# EAGLE design zero_board (EAGLE 6.6.0)
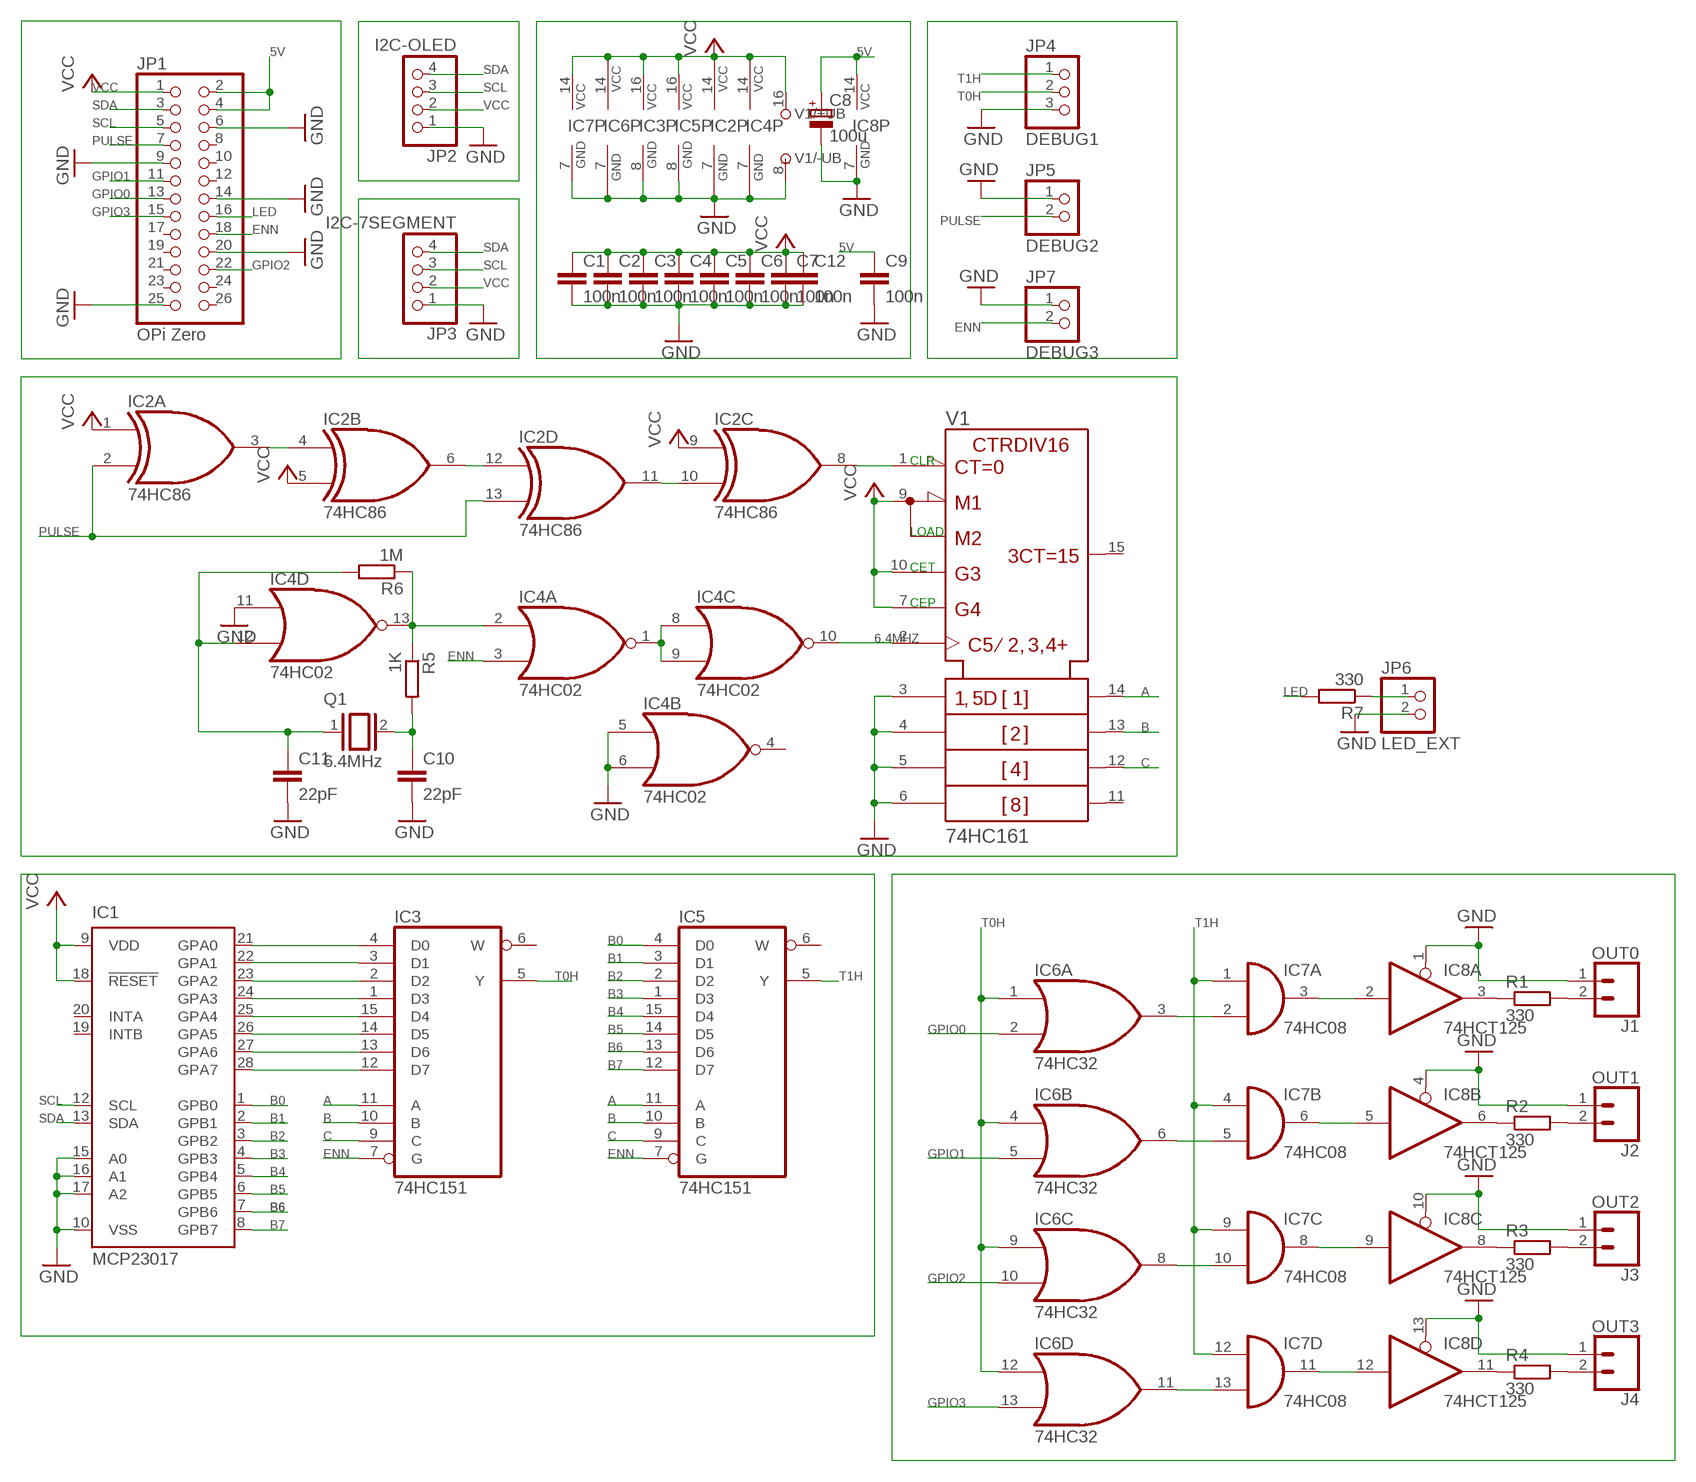
[diagram p0: schematic, sheet 1]

## Parts
C1  100n  C-EU050-024X044  [C050-024X044]
C2  100n  C-EU050-024X044  [C050-024X044]
C3  100n  C-EU050-024X044  [C050-024X044]
C4  100n  C-EU050-024X044  [C050-024X044]
C5  100n  C-EU050-024X044  [C050-024X044]
C6  100n  C-EU050-024X044  [C050-024X044]
C7  100n  C-EU050-024X044  [C050-024X044]
C8  100u  CPOL-EUE2.5-6  [E2,5-6]
C9  100n  C-EU050-024X044  [C050-024X044]
C10  22pF  C-EU050-024X044  [C050-024X044]
C11  22pF  C-EU050-024X044  [C050-024X044]
C12  100n  C-EU050-024X044  [C050-024X044]
IC1  MCP23017  MCP23017SP  [DIL28-3]
IC2  74HC86  74LS86N  [DIL14]
IC3  74HC151  74HC151N  [DIL16]
IC4  74HC02  7402N  [DIL14]
IC5  74HC151  74HC151N  [DIL16]
IC6  74HC32  74LS32N  [DIL14]
IC7  74HC08  74AS08N  [DIL14]
IC8  74HCT125  74HC125N  [DIL14]
J1  OUT0  CONN_023.5MM  [SCREWTERMINAL-3.5MM-2]
J2  OUT1  CONN_023.5MM  [SCREWTERMINAL-3.5MM-2]
J3  OUT2  CONN_023.5MM  [SCREWTERMINAL-3.5MM-2]
J4  OUT3  CONN_023.5MM  [SCREWTERMINAL-3.5MM-2]
JP1  OPi Zero  PINHD-2X13  [2X13]
JP2  I2C-OLED  PINHD-1X4  [1X04]
JP3  I2C-7SEGMENT  PINHD-1X4  [1X04]
JP4  DEBUG1  PINHD-1X3/90  [1X03/90]
JP5  DEBUG2  PINHD-1X2/90  [1X02/90]
JP6  LED_EXT  PINHD-1X2/90  [1X02/90]
JP7  DEBUG3  PINHD-1X2/90  [1X02/90]
Q1  6.4MHz  XTAL/S  [QS]
R1  330  R-EU_0204/5  [0204/5]
R2  330  R-EU_0204/5  [0204/5]
R3  330  R-EU_0204/5  [0204/5]
R4  330  R-EU_0204/5  [0204/5]
R5  1K  R-EU_0204/2V  [0204V]
R6  1M  R-EU_0204/2V  [0204V]
R7  330  R-EU_0204/2V  [0204V]
V1  74HC161  74161N  [DIL16]

## Nets
5V: C8.+ C9.1 IC8.14(P:VCC) JP1.2 JP1.4
6.4MHZ: IC4.10(C:O) V1.2(CLK)
A: IC3.11(A) IC5.11(A) V1.14(QA)
B: IC3.10(B) IC5.10(B) V1.13(QB)
B0: IC1.1(GPB0) IC5.4(D0)
B1: IC1.2(GPB1) IC5.3(D1)
B2: IC1.3(GPB2) IC5.2(D2)
B3: IC1.4(GPB3) IC5.1(D3)
B4: IC1.5(GPB4) IC5.15(D4)
B5: IC1.6(GPB5) IC5.14(D5)
B6: IC1.7(GPB6) IC5.13(D6)
B7: IC1.8(GPB7) IC5.12(D7)
C: IC3.9(C) IC5.9(C) V1.12(QC)
ENN: IC3.7(G) IC4.3(A:I1) IC5.7(G) JP1.18 JP7.2
GND: C1.2 C2.2 C3.2 C4.2 C5.2 C6.2 C7.2 C8.- C9.2 C10.2 C11.2 C12.2 IC1.10(VSS) IC1.15(A0) IC1.16(A1) IC1.17(A2) IC2.7(P:GND) IC3.8(GND) IC4.5(B:I0) IC4.6(B:I1) IC4.7(P:GND) IC4.11(D:I0) IC5.8(GND) IC6.7(P:GND) IC7.7(P:GND) IC8.1(A:OE) IC8.4(B:OE) IC8.7(P:GND) IC8.10(C:OE) IC8.13(D:OE) J1.1 J2.1 J3.1 J4.1 JP1.6 JP1.9 JP1.14 JP1.20 JP1.25 JP2.1 JP3.1 JP4.3 JP5.1 JP6.2 JP7.1 V1.3(A) V1.4(B) V1.5(C) V1.6(D) V1.8(-UB)
GPIO0: IC6.2(A:I1) JP1.13
GPIO1: IC6.5(B:I1) JP1.11
GPIO2: IC6.10(C:I1) JP1.22
GPIO3: IC6.13(D:I1) JP1.15
LED: JP1.16 R7.2
N$1: IC2.3(A:O) IC2.4(B:I0)
N$2: IC2.6(B:O) IC2.12(D:I0)
N$3: IC2.10(C:I1) IC2.11(D:O)
N$4: IC2.8(C:O) V1.1(!CLR)
N$5: IC6.3(A:O) IC7.2(A:I1)
N$6: IC6.6(B:O) IC7.5(B:I1)
N$7: IC1.21(GPA0) IC3.4(D0)
N$8: IC1.22(GPA1) IC3.3(D1)
N$9: IC1.23(GPA2) IC3.2(D2)
N$10: IC1.24(GPA3) IC3.1(D3)
N$11: IC1.25(GPA4) IC3.15(D4)
N$12: IC1.26(GPA5) IC3.14(D5)
N$13: IC1.27(GPA6) IC3.13(D6)
N$14: IC1.28(GPA7) IC3.12(D7)
N$15: IC6.8(C:O) IC7.10(C:I1)
N$16: IC6.11(D:O) IC7.13(D:I1)
N$17: IC7.11(D:O) IC8.12(D:I)
N$18: IC7.8(C:O) IC8.9(C:I)
N$19: IC7.6(B:O) IC8.5(B:I)
N$20: IC7.3(A:O) IC8.2(A:I)
N$21: IC8.3(A:O) R1.1
N$22: J1.2 R1.2
N$23: IC8.6(B:O) R2.1
N$24: J2.2 R2.2
N$25: IC8.8(C:O) R3.1
N$26: J3.2 R3.2
N$27: IC8.11(D:O) R4.1
N$28: J4.2 R4.2
N$35: IC4.1(A:O) IC4.8(C:I0) IC4.9(C:I1)
N$37: IC4.2(A:I0) IC4.13(D:O) R5.1 R6.1
N$38: C10.1 Q1.2 R5.2
N$39: JP6.1 R7.1
N$41: C11.1 IC4.12(D:I1) Q1.1 R6.2
PULSE: IC2.2(A:I1) IC2.13(D:I1) JP1.7 JP5.2
SCL: IC1.12(SCL) JP1.5 JP2.3 JP3.3
SDA: IC1.13(SDA) JP1.3 JP2.4 JP3.4
T0H: IC3.5(Y) IC6.1(A:I0) IC6.4(B:I0) IC6.9(C:I0) IC6.12(D:I0) JP4.2
T1H: IC5.5(Y) IC7.1(A:I0) IC7.4(B:I0) IC7.9(C:I0) IC7.12(D:I0) JP4.1
VCC: C1.1 C2.1 C3.1 C4.1 C5.1 C6.1 C7.1 C12.1 IC1.9(VDD) IC1.18(!RESET) IC2.1(A:I0) IC2.5(B:I1) IC2.9(C:I0) IC2.14(P:VCC) IC3.16(VCC) IC4.14(P:VCC) IC5.16(VCC) IC6.14(P:VCC) IC7.14(P:VCC) JP1.1 JP2.2 JP3.2 V1.7(ENP) V1.9(!LOAD) V1.10(ENT) V1.16(+UB)
Unconnected: IC1.19(INTB) IC1.20(INTA) IC3.6(W) IC4.4(B:O) IC5.6(W) JP1.8 JP1.10 JP1.12 JP1.17 JP1.19 JP1.21 JP1.23 JP1.24 JP1.26 V1.11(QD) V1.15(RCO)

## Notes on the sheet
- CLR
- LOAD
- CET
- CEP

## Library data of the parts
C1-C7 C9-C12 = rcl:C-EU: CAPACITOR, European symbol
C8 = rcl:CPOL-EU: POLARIZED CAPACITOR, European symbol
IC1 = microchip:MCP23017: http://ww1.microchip.com/downloads/en/DeviceDoc/21952a.pdf Source: http://ww1.microchip.com/downloads/en/DeviceDoc/21952a.pdf; MF: MICROCHIP; MPN: MCP23017-E/SP; OC_FARNELL: 1332088; OC_NEWARK: 31K2959
IC2 = 74xx-us:74*86: Quad 2-input EXCLUSIV-OR (XOR) gate
IC3 IC5 = 74xx-eu:74*151: Data SELECTOR/MULTIPLEXER
IC4 = 74xx-us:74*02: Quad 2-input NOR gate
IC6 = 74xx-us:74*32: Quad 2-input OR gate
IC7 = 74xx-eu:74*08: Quad 2-input AND gate
IC8 = 74xx-eu:74*125: Quad bus BUFFER, 3-state
J1-J4 = SparkFun-Connectors:CONN_02: Multi connection point. Often used as Generic Header-pin footprint for 0.1 inch spaced/style header connections On any of the 0.1 inch spaced packages, you can populate with these: Break Away Headers - Straight <https://www.sparkfun.com/products/116> (PRT-00116) Break Away Male Headers - Right Angle <https://www.sparkfun.com/products/553> (PRT-00553) Female Headers <https://www.sparkfun.com/products/115> (PRT-00115) Break Away Headers - Machine Pin <https://www.sparkfun.com/products/117> (PRT-00117) Break Away Female Headers - Swiss Machine Pin <https://www.sparkfun.com/products/743> (PRT-00743) For SCREWTERMINALS and SPRING TERMINALS visit here: Screw Terimnals on SparkFun.com <https://www.sparkfun.com/search/results?term=Screw+Terminals> (5mm/3.5mm/2.54mm spacing) This device is also useful as a general connection point to wire up your design to another part of your project. Our various solder wires solder well into these plated through hole pads. Hook-Up Wire - Assortment (Stranded, 22 AWG) <https://www.sparkfun.com/products/11375> (PRT-11375) Hook-Up Wire - Assortment (Solid Core, 22 AWG) <https://www.sparkfun.com/products/11367> (PRT-11367) View the entire wire category on our website here <https://www.sparkfun.com/categories/141> Special notes: Molex polarized connector foot print use with: PRT-08233 with associated crimp pins and housings. 2.54_SCREWTERM for use with PRT-10571. 3.5mm Screw Terminal footprints for PRT-08084 5mm Screw Terminal footprints for use with PRT-08432; PROD_ID: CONN-08399
JP1 = pinhead:PINHD-2X13: PIN HEADER
JP2 JP3 = pinhead:PINHD-1X4: PIN HEADER
JP4 = pinhead:PINHD-1X3: PIN HEADER
JP5-JP7 = pinhead:PINHD-1X2: PIN HEADER
Q1 = special:XTAL/S: CRYSTAL
R1-R7 = resistor:R-EU_: RESISTOR, European symbol
V1 = 74ttl-din:74*161: Synchrounus 4-bit COUNTER

## Board
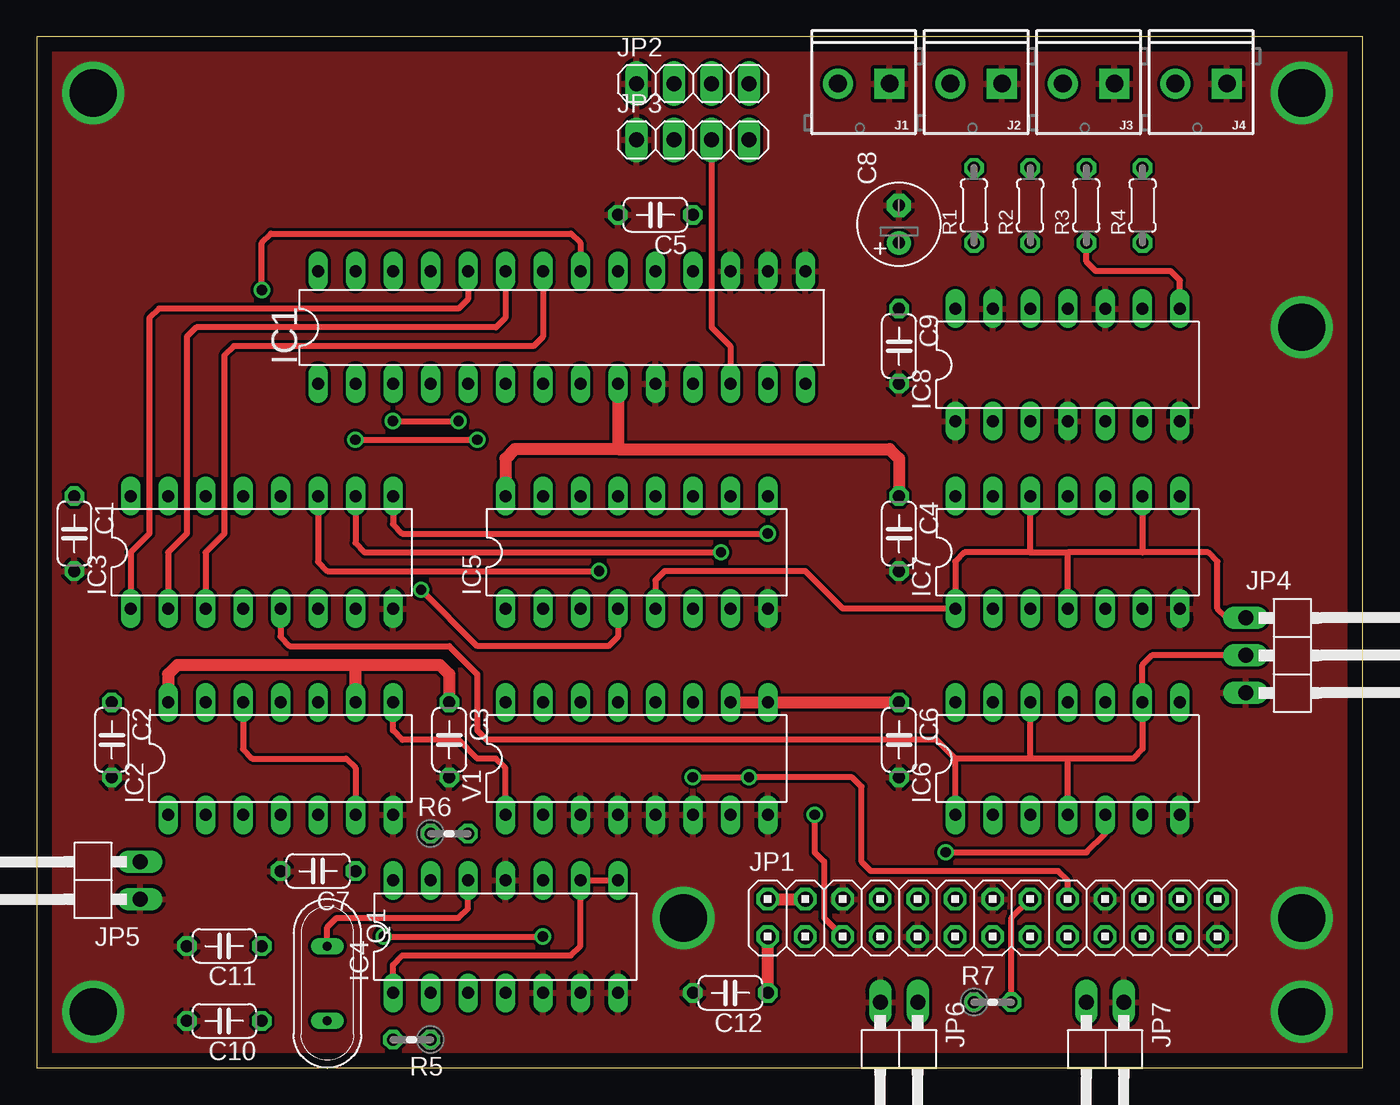
[diagram p1: board, top side]
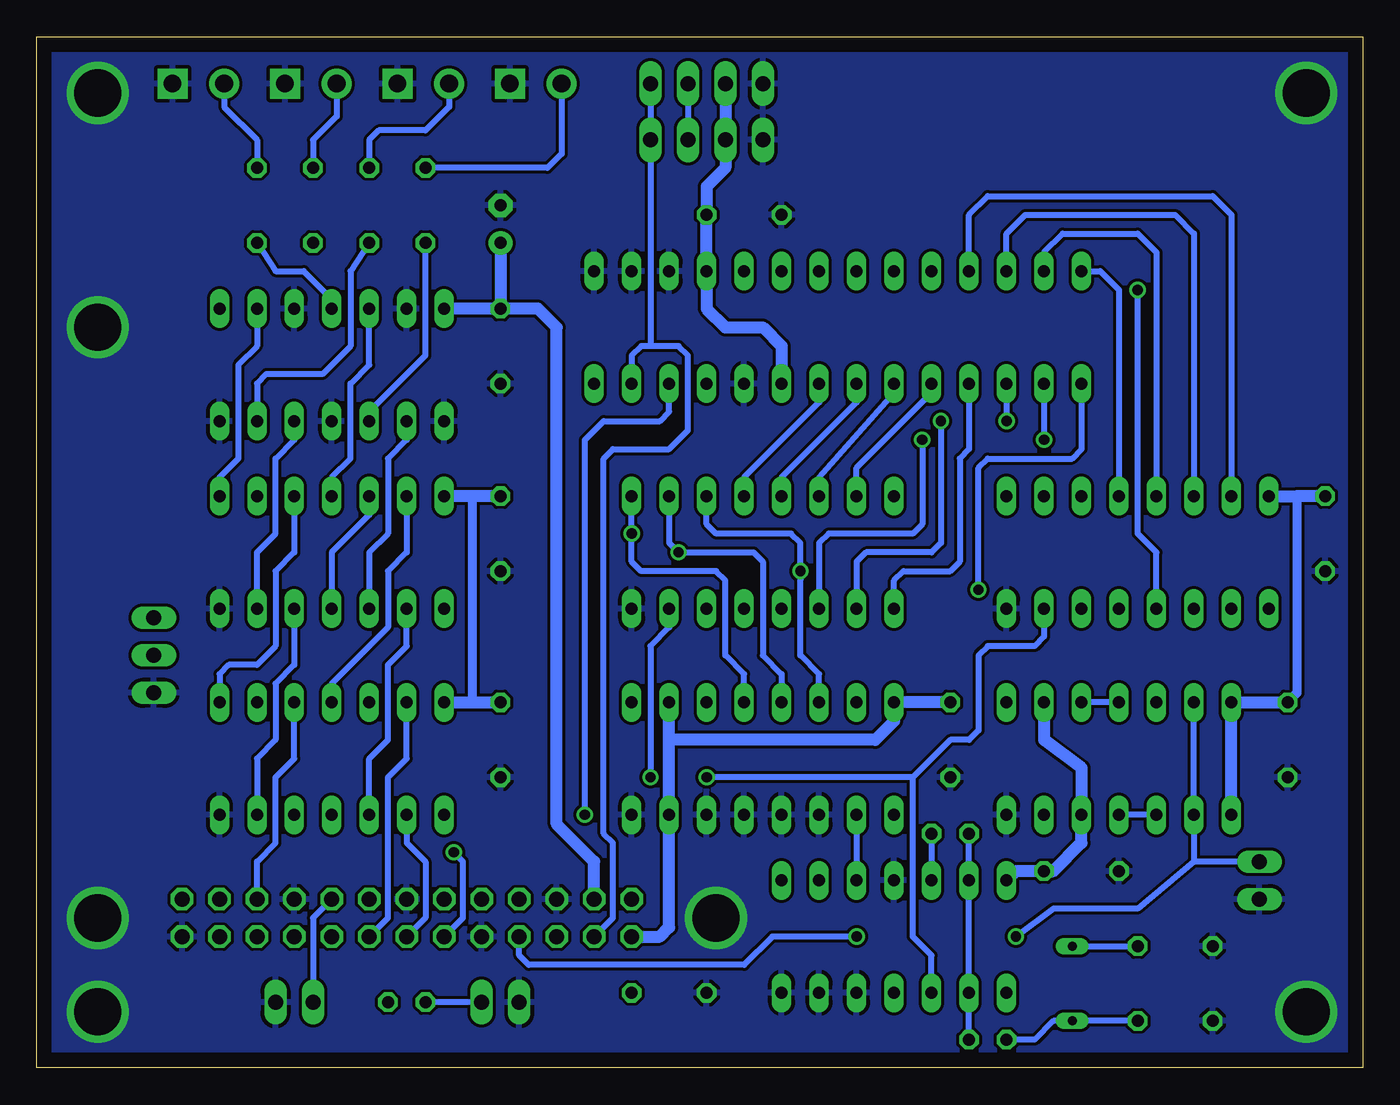
[diagram p2: board, bottom side, seen from below]

Size 89.84 x 69.84 mm. Coordinates in mm from the lower left corner, seen from the top.
Outline: 0,0 89.84,0 89.84,69.84 0,69.84 0,0
Copper layers (1*16): Top 0.035mm / dielectric 1.5mm / Bottom 0.035mm
Design rules "default": minimum track width 10mil, minimum drill 24mil, track to track 8mil, track to pad 8mil, pad to pad 8mil, via to via 8mil, smd to smd 8mil, copper to edge 40mil, drill to drill 8mil, minimum pad ring 10mil, minimum via ring 8mil, stop-mask expansion 4mil, vias tented up to drill 0mil, thermal gap 10mil

### Footprints (pad centres in the part's own frame; a part is rotated, then mirrored left to right if it is on the bottom)
C050-024X044 = drill 0.813 octagon: 1 -2.54,0; 2 2.54,0
E2,5-6 = drill 0.813 pad 1.6: + -1.27,0 | drill 0.813 pad 1.6 octagon: - 1.27,0
DIL28-3 = drill 0.813 long: 1 -16.51,-3.81; 2 -13.97,-3.81; 3 -11.43,-3.81; 4 -8.89,-3.81; 5 -6.35,-3.81; 6 -3.81,-3.81; 7 -1.27,-3.81; 8 1.27,-3.81; 9 3.81,-3.81; 10 6.35,-3.81; 11 8.89,-3.81; 12 11.43,-3.81; 13 13.97,-3.81; 14 16.51,-3.81; 15 16.51,3.81; 16 13.97,3.81; 17 11.43,3.81; 18 8.89,3.81; 19 6.35,3.81; 20 3.81,3.81; 21 1.27,3.81; 22 -1.27,3.81; 23 -3.81,3.81; 24 -6.35,3.81; 25 -8.89,3.81; 26 -11.43,3.81; 27 -13.97,3.81; 28 -16.51,3.81
DIL14 = drill 0.813 long: 1 -7.62,-3.81; 2 -5.08,-3.81; 3 -2.54,-3.81; 4 0,-3.81; 5 2.54,-3.81; 6 5.08,-3.81; 7 7.62,-3.81; 8 7.62,3.81; 9 5.08,3.81; 10 2.54,3.81; 11 0,3.81; 12 -2.54,3.81; 13 -5.08,3.81; 14 -7.62,3.81
DIL16 = drill 0.813 long: 1 -8.89,-3.81; 2 -6.35,-3.81; 3 -3.81,-3.81; 4 -1.27,-3.81; 5 1.27,-3.81; 6 3.81,-3.81; 7 6.35,-3.81; 8 8.89,-3.81; 9 8.89,3.81; 10 6.35,3.81; 11 3.81,3.81; 12 1.27,3.81; 13 -1.27,3.81; 14 -3.81,3.81; 15 -6.35,3.81; 16 -8.89,3.81
SCREWTERMINAL-3.5MM-2 = drill 1.2 pad 2.032 square: 1 0,0 | drill 1.2 pad 2.032: 2 3.5,0
2X13 = drill 1.016 octagon: 1 -15.24,-1.27; 2 -15.24,1.27; 3 -12.7,-1.27; 4 -12.7,1.27; 5 -10.16,-1.27; 6 -10.16,1.27; 7 -7.62,-1.27; 8 -7.62,1.27; 9 -5.08,-1.27; 10 -5.08,1.27; 11 -2.54,-1.27; 12 -2.54,1.27; 13 0,-1.27; 14 0,1.27; 15 2.54,-1.27; 16 2.54,1.27; 17 5.08,-1.27; 18 5.08,1.27; 19 7.62,-1.27; 20 7.62,1.27; 21 10.16,-1.27; 22 10.16,1.27; 23 12.7,-1.27; 24 12.7,1.27; 25 15.24,-1.27; 26 15.24,1.27
1X04 = drill 1.016 long: 1 -3.81,0; 2 -1.27,0; 3 1.27,0; 4 3.81,0
1X03/90 = drill 1.016 long: 1 -2.54,-3.81; 2 0,-3.81; 3 2.54,-3.81
1X02/90 = drill 1.016 long: 1 -1.27,-3.81; 2 1.27,-3.81
QS = drill 0.61 long: 1 -2.54,0; 2 2.54,0
0204/5 = drill 0.813 octagon: 1 -2.54,0; 2 2.54,0
0204V = drill 0.813 octagon: 1 -1.27,0; 2 1.27,0

### Placement (x,y rotation side)
C1  2.54,36.2 270 top
C2  5.08,22.23 270 top
C3  27.94,22.23 270 top
C4  58.42,36.2 270 top
C5  41.91,57.78 180 top
C6  58.42,22.23 270 top
C7  19.05,13.34 180 top
C8  58.42,57.15 90 top
C9  58.42,48.89 270 top
C10  12.7,3.18 180 top
C11  12.7,8.26 180 top
C12  46.99,5.08 180 top
IC1  35.56,50.16 0 top
IC2  16.51,20.96 0 top
IC3  15.24,34.92 0 top
IC4  31.75,8.89 0 top
IC5  40.64,34.92 0 top
IC6  69.85,20.96 0 top
IC7  69.85,34.92 0 top
IC8  69.85,47.62 0 top
J1  57.78,66.67 180 top
J2  65.41,66.67 180 top
J3  73.03,66.67 180 top
J4  80.65,66.67 180 top
JP1  64.77,10.16 0 top
JP2  44.45,66.67 0 top
JP3  44.45,62.87 0 top
JP4  85.73,27.94 270 top
JP5  3.17,12.7 90 top
JP6  58.42,0.64 180 top
JP7  72.39,0.64 180 top
Q1  19.69,5.71 270 top
R1  63.5,58.42 90 top
R2  67.31,58.42 90 top
R3  71.12,58.42 90 top
R4  74.93,58.42 90 top
R5  25.4,1.9 180 top
R6  27.94,15.88 0 top
R7  64.77,4.45 0 top
V1  40.64,20.96 0 top

### Tracks (layer width: path | path; a pad name or v marks a point on that pad's centre or on a via)
5V
  Top 0.813: JP1.2 JP1.4
  Bottom 0.813: C9.1 IC8.14 | JP1.4 52.07,13.97 54.61,16.51 54.61,50.16 55.88,51.43 C9.1 | C8.+ C9.1
6.4MHZ
  Bottom 0.406: V1.2 IC4.10
A  (via drill 0.7)
  Top 0.406: IC3.11 19.05,34.29 19.69,33.65 v38.1,33.65
  Bottom 0.406: V1.14 36.83,26.67 38.1,27.94 38.1,33.02 v38.1,33.65 38.1,35.56 38.73,36.2 43.81,36.2 44.45,36.83 IC5.11
B  (via drill 0.7)
  Top 0.406: IC3.10 21.59,35.56 22.23,34.92 v46.35,34.92
  Bottom 0.406: IC5.10 46.99,35.56 v46.35,34.92 41.27,34.92 40.64,34.29 40.64,27.94 39.37,26.67 V1.13
B0  (via drill 0.7)
  Top 0.406: IC5.4 39.37,29.21 38.73,28.57 29.85,28.57 v26.04,32.38
  Bottom 0.406: IC1.1 19.05,41.91 19.69,41.27 25.4,41.27 26.04,40.64 v26.04,32.38
B1  (via drill 0.7)
  Top 0.406: v21.59,42.54 v29.85,42.54
  Bottom 0.406: IC1.2 v21.59,42.54 | v29.85,42.54 29.85,36.83 30.48,36.2 36.2,36.2 36.83,35.56 IC5.3
B2  (via drill 0.7)
  Top 0.406: v24.13,43.81 v28.58,43.81
  Bottom 0.406: IC1.3 v24.13,43.81 | v28.58,43.81 28.58,35.56 29.21,34.92 33.66,34.92 34.29,34.29 IC5.2
B3
  Bottom 0.406: IC1.4 26.67,41.91 27.31,41.27 27.31,34.29 27.94,33.65 31.12,33.65 31.75,33.02 IC5.1
B4
  Bottom 0.406: IC5.15 34.29,40.64 29.21,45.72 IC1.5
B5
  Bottom 0.406: IC5.14 36.83,40 31.75,45.72 IC1.6
B6
  Bottom 0.406: IC5.13 39.37,40 34.29,45.08 IC1.7
B7
  Bottom 0.406: IC5.12 41.91,40 36.83,45.08 IC1.8
C  (via drill 0.7)
  Top 0.406: IC3.9 24.13,36.83 24.77,36.2 v49.53,36.2
  Bottom 0.406: V1.12 41.91,26.67 43.18,27.94 43.18,33.02 43.81,33.65 48.89,33.65 49.53,34.29 v49.53,36.2 49.53,38.1 IC5.9
ENN  (via drill 0.7)
  Top 0.406: v44.45,19.68 v48.26,19.68 55.24,19.68 55.88,19.05 55.88,13.97 56.52,13.34 69.22,13.34 69.85,12.7 JP1.18
  Bottom 0.406: IC5.7 46.99,29.84 48.26,28.57 v48.26,19.68 | IC3.7 21.59,29.21 22.23,28.57 25.4,28.57 26.04,27.94 26.04,22.86 26.67,22.23 27.94,22.23 30.48,19.68 | 30.48,19.68 v44.45,19.68 | IC4.3 29.21,7.62 30.48,8.89 30.48,19.68 | JP1.18 71.12,10.16 JP7.2
GND  (via drill 3.2)
  other vias: 85.73,3.81 3.81,3.81 3.81,66.04 85.73,66.04 85.73,10.16 43.81,10.16 85.73,50.16
  pour Bottom: -1.27,0 90.81,0 90.81,70.48 -0.64,70.48
  pour Top: -0.64,0 90.17,0 90.17,69.85 -0.64,69.85
GPIO0
  Bottom 0.406: IC6.2 64.77,15.24 63.5,13.97 63.5,10.16 JP1.13
GPIO1  (via drill 0.7)
  Top 0.406: v61.59,14.61 71.12,14.61 72.39,15.88 IC6.5
  Bottom 0.406: JP1.11 60.96,10.16 60.96,13.97 v61.59,14.61
GPIO2
  Bottom 0.406: JP1.22 74.93,13.97 73.66,15.24 73.66,19.68 72.39,20.96 IC6.10
GPIO3
  Bottom 0.406: JP1.15 66.04,10.16 66.04,19.68 64.77,20.96 IC6.13
LED
  Top 0.406: R7.2 66.04,10.16 JP1.16
N$1
  Bottom 0.406: IC2.3 IC2.4
N$2
  Top 0.406: IC2.12 13.97,21.59 14.61,20.96 20.96,20.96 21.59,20.32 IC2.6
N$3
  Bottom 0.406: IC2.11 IC2.10
N$4
  Top 0.406: V1.1 31.75,20.32 31.12,20.96 29.85,20.96 28.58,22.23 24.77,22.23 24.13,22.86 IC2.8
N$5
  Bottom 0.406: IC6.3 67.31,20.96 66.04,22.23 66.04,27.3 64.77,28.57 IC7.2
N$6
  Bottom 0.406: IC7.5 72.39,27.3 73.66,26.04 73.66,22.23 74.93,20.96 IC6.6
N$7  (via drill 0.7)
  Top 0.406: v15.24,52.7 15.24,55.88 15.88,56.51 36.2,56.51 36.83,55.88 IC1.21
  Bottom 0.406: IC3.4 13.97,34.92 15.24,36.2 v15.24,52.7
N$8
  Top 0.406: IC1.22 34.29,49.53 33.66,48.89 13.33,48.89 12.7,48.26 12.7,36.2 11.43,34.92 IC3.3
N$9
  Top 0.406: IC1.23 31.75,50.8 31.12,50.16 10.79,50.16 10.16,49.53 10.16,36.2 8.89,34.92 IC3.2
N$10
  Top 0.406: IC1.24 29.21,52.07 28.58,51.43 8.26,51.43 7.62,50.8 7.62,36.2 6.35,34.92 IC3.1
N$11
  Bottom 0.406: IC1.25 26.67,57.78 25.4,59.05 10.16,59.05 8.89,57.78 IC3.15
N$12
  Bottom 0.406: IC1.26 24.13,56.51 22.86,57.78 12.7,57.78 11.43,56.51 IC3.14
N$13
  Bottom 0.406: IC1.27 21.59,55.24 20.32,56.51 15.24,56.51 13.97,55.24 IC3.13
N$14
  Bottom 0.406: IC1.28 17.78,53.97 16.51,52.7 IC3.12
N$15
  Bottom 0.406: IC7.10 72.39,34.92 73.66,33.65 73.66,28.57 74.93,27.3 76.84,27.3 77.47,26.67 IC6.8
N$16
  Bottom 0.406: IC7.13 64.77,34.92 66.04,33.65 66.04,29.84 69.85,26.04 IC6.11
N$17
  Bottom 0.406: IC7.11 69.85,40 68.58,41.27 68.58,46.35 67.31,47.62 IC8.12
N$18
  Bottom 0.406: IC7.8 77.47,40 76.2,41.27 76.2,47.62 74.93,48.89 IC8.9
N$19
  Bottom 0.406: IC7.6 74.93,34.92 73.66,36.2 73.66,41.27 72.39,42.54 IC8.5
N$20
  Bottom 0.406: IC8.2 64.77,42.54 66.04,41.27 66.04,36.2 67.31,34.92 IC7.3
N$21
  Bottom 0.406: IC8.3 67.31,44.45 63.5,48.26 R1.1
N$22
  Bottom 0.406: J1.2 54.28,61.92 55.24,60.96 R1.2
N$23
  Bottom 0.406: R2.1 68.58,53.97 68.58,48.89 70.48,46.99 74.3,46.99 74.93,46.35 IC8.6
N$24
  Bottom 0.406: J2.2 61.91,65.09 63.5,63.5 66.68,63.5 67.31,62.87 R2.2
N$25
  Top 0.406: IC8.8 77.47,53.34 76.84,53.97 71.76,53.97 71.12,54.61 R3.1
N$26
  Bottom 0.406: J3.2 69.53,64.46 71.12,62.87 R3.2
N$27
  Bottom 0.406: IC8.11 69.85,52.07 71.76,53.97 73.66,53.97 R4.1
N$28
  Bottom 0.406: J4.2 77.15,65.08 74.93,62.87 R4.2
N$35
  Top 0.406: IC4.8 IC4.9 36.83,8.26 36.2,7.62 24.77,7.62 24.13,6.99 IC4.1
N$37
  Bottom 0.406: R5.1 IC4.2 IC4.13 R6.1
N$38
  Bottom 0.406: R5.2 22.23,1.9 20.96,3.18 Q1.2 C10.1
N$39
  Bottom 0.406: JP6.1 R7.1
N$41
  Top 0.406: Q1.1 19.69,9.53 20.32,10.16 28.58,10.16 29.21,10.79 IC4.12
  Bottom 0.406: Q1.1 C11.1 | R6.2 IC4.12
PULSE  (via drill 0.7)
  Top 0.406: v23.5,8.89 v34.29,8.89
  Bottom 0.406: IC2.13 IC2.2 11.43,13.97 | 11.43,13.97 15.24,10.79 20.96,10.79 v23.5,8.89 | v34.29,8.89 40,8.89 41.91,6.99 56.52,6.99 57.15,7.62 JP1.7 | JP5.2 11.43,13.97
SCL  (via drill 0.7)
  Top 0.406: v52.7,17.14 52.7,14.61 53.34,13.97 53.34,10.16 JP1.5 | JP3.3 45.72,50.16 46.99,48.89 IC1.12
  Bottom 0.406: v52.7,17.14 52.7,42.54 51.43,43.81 47.62,43.81 46.99,44.45 IC1.12 | JP2.3 JP3.3
SDA
  Bottom 0.406: 48.26,48.89 46.35,48.89 45.72,48.26 45.72,43.18 46.99,41.91 50.8,41.91 51.43,41.27 51.43,15.88 50.8,15.24 50.8,10.16 JP1.3 | 48.26,48.89 48.89,48.89 49.53,48.26 IC1.13 | 48.26,48.89 JP3.4 JP2.4
T0H
  Top 0.406: IC6.4 69.85,20.96 | 67.31,20.96 IC6.12 | IC3.5 16.51,29.21 17.15,28.57 27.94,28.57 29.85,26.67 29.85,22.86 30.48,22.23 60.96,22.23 62.23,20.96 | IC6.1 62.23,20.96 | 69.85,20.96 74.3,20.96 74.93,21.59 IC6.9 74.93,27.3 75.57,27.94 JP4.2 | 69.85,20.96 67.31,20.96 | 67.31,20.96 62.23,20.96
T1H
  Top 0.406: IC7.9 74.93,34.92 | 74.93,34.92 69.85,34.92 | 67.31,34.92 IC7.12 | 67.31,34.92 69.85,34.92 | IC7.4 69.85,34.92 | 67.31,34.92 62.86,34.92 62.23,34.29 IC7.1 54.61,31.11 52.07,33.65 42.54,33.65 41.91,33.02 IC5.5 | 74.93,34.92 79.38,34.92 80.01,34.29 80.01,31.11 80.65,30.48 JP4.1
  Bottom 0.406: IC7.12 67.31,37.46 69.85,34.92 IC7.4
VCC
  Top 0.813: IC1.9 39.37,41.91 | 39.37,41.91 32.38,41.91 31.75,41.27 IC5.16 | V1.10 V1.9 C6.1 | 39.37,41.91 57.78,41.91 58.42,41.27 C4.1 | IC2.9 21.59,27.3 | 21.59,27.3 27.31,27.3 27.94,26.67 C3.1 | 21.59,27.3 9.53,27.3 8.89,26.67 IC2.14 | C12.1 JP1.1
  Bottom 0.61: 60.32,24.77 60.32,38.73 | 4.45,38.73 4.45,25.4 C2.1
  Bottom 0.813: IC1.9 39.37,48.89 40.64,50.16 43.18,50.16 44.45,51.43 IC1.18 C5.1 44.45,59.69 43.18,60.96 JP3.2 JP2.2 | 46.99,22.23 V1.7 46.99,9.53 47.62,8.89 JP1.1 | 46.99,22.23 V1.10 | IC2.9 21.59,22.23 19.05,20.32 IC2.5 19.05,15.24 20.96,13.34 C7.1 23.5,13.34 IC4.14 | IC2.1 IC2.14 C2.1 | C1.1 4.45,38.73 IC3.16 | 46.99,22.23 33.02,22.23 31.75,23.5 V1.16 C3.1 | C6.1 60.32,24.77 IC6.14 | C4.1 60.32,38.73 IC7.14